# Altium schematic sheet BLOCK DIAGRAM.SchDoc
size 420 x 297 mm; SheetNumber: 1; SheetTotal: 7
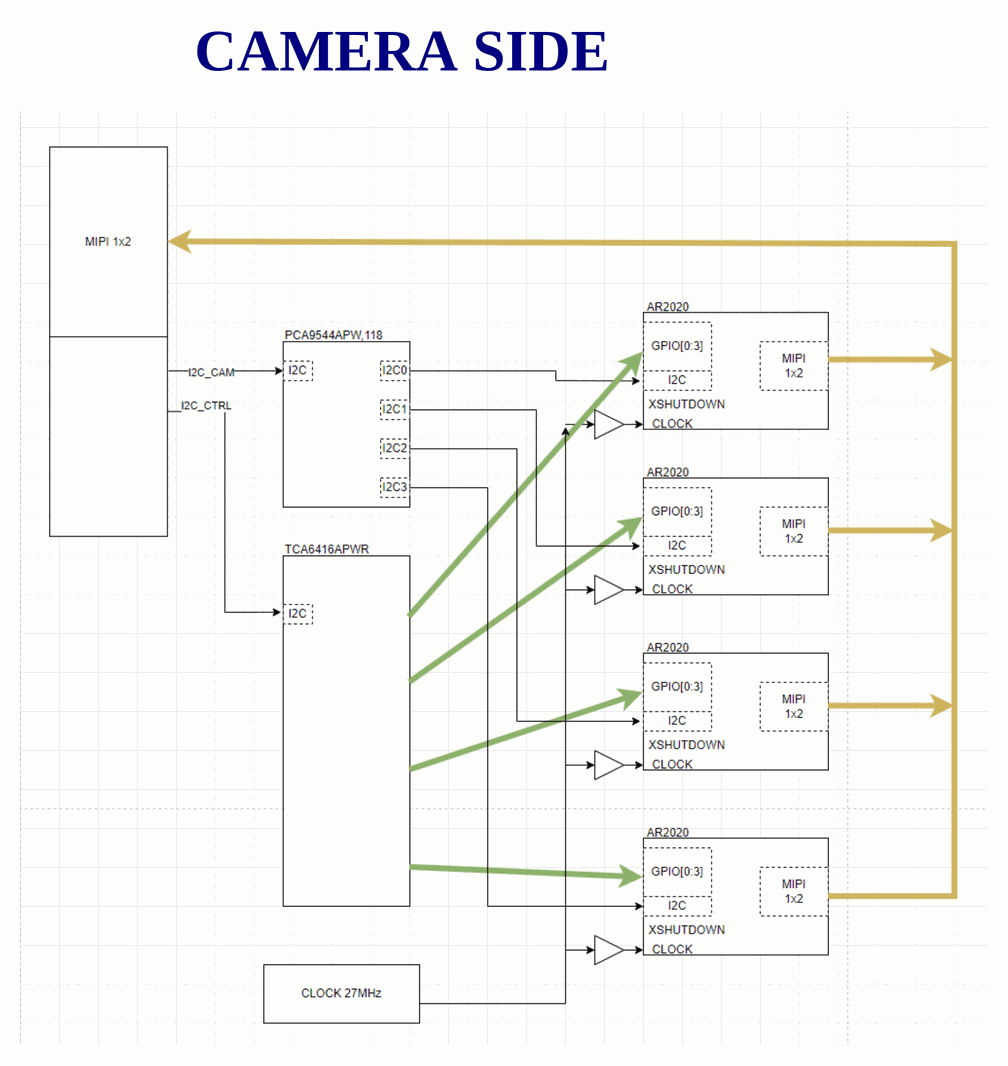
[diagram p0: BLOCK DIAGRAM.SchDoc]

## Notes on the sheet
- CAMERA SIDE
- Project:
- Sub-system:
- Design by:
- Sheet title:
- Sheet
- of
- Checked by:
- Approved by:
- Revision:
- Document No:
- Size:
- Date:
- A3